# Altium schematic sheet C210_0005_NINA_Module.SchDoc: C210_0005_NINA_Module
size B; Date: 2/26/2021; CompanyName: U-blox; DrawnBy: EMOO; Engineer: EMOO; Organization: U-blox; Address1: 2601 25th St. SE; Address2: Salem, OR 97302; SheetNumber: 5; SheetTotal: 7; Website: www.u-blox.com; SheetSize: B; SheetTitle: C-210NINA Module
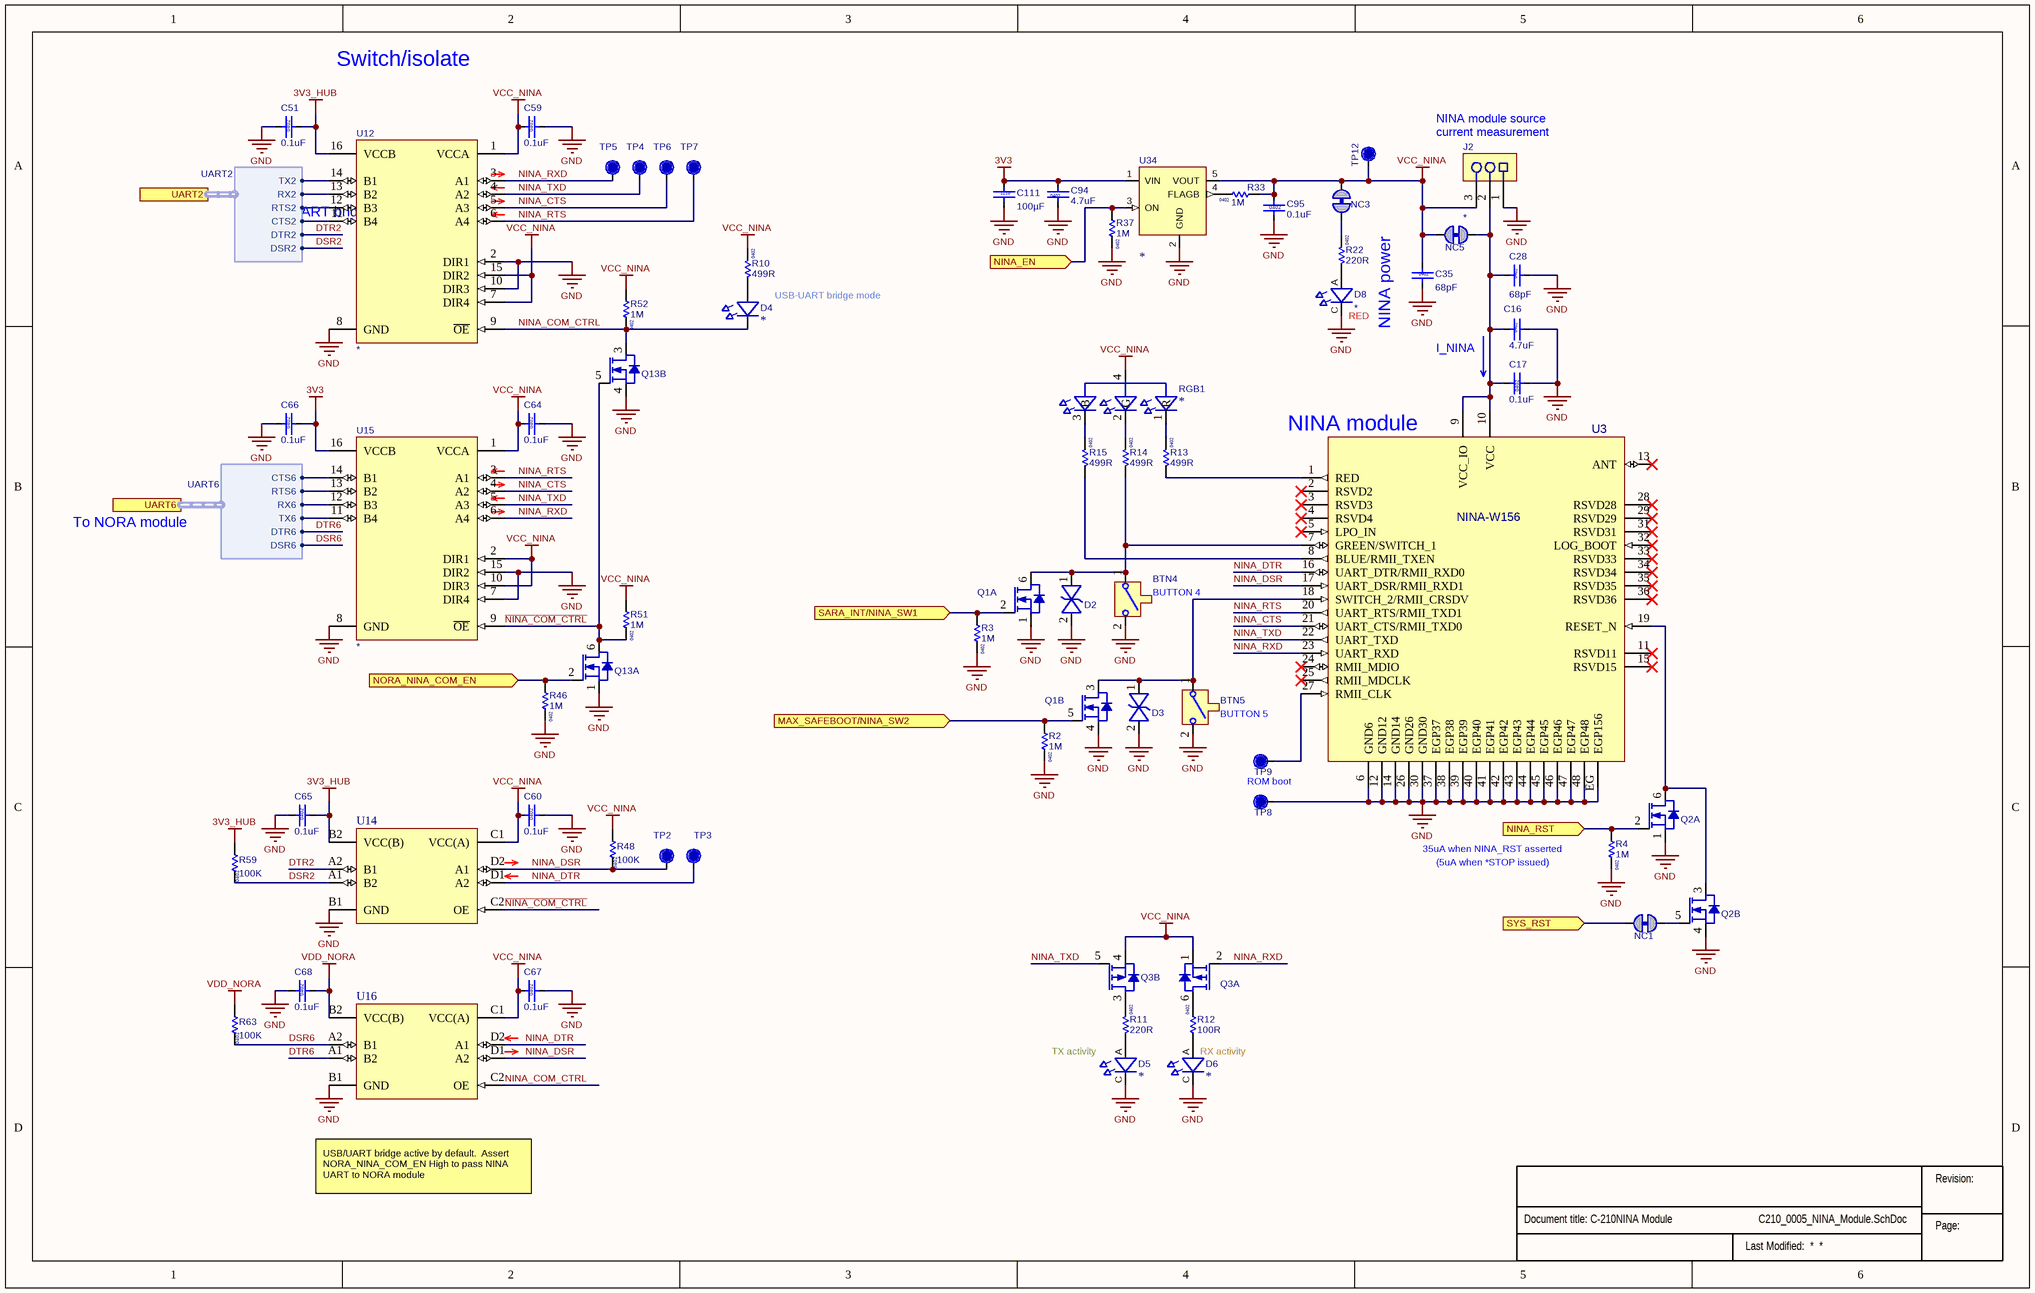
[diagram p0: C210_0005_NINA_Module.SchDoc]

## Parts
?  (no value)  (graphical)
BTN4  (no value)  [B3U-1000P]
BTN5  (no value)  [B3U-1000P]
C16  value 4.7uF  Size: 0402  [Cap 0402 HD]
C17  value 0.1uF  Size: 0402  [Cap 0402 HD]  (hidden comment: 120-000160.1uF)
C28  value 68pF  Size: 0402  [Cap 0402 HD]
C35  value 68pF  Size: 0402  [Cap 0402 HD]
C51  value 0.1uF  Size: 0402  [Cap 0402 HD]  (hidden comment: 120-000160.1uF)
C59  value 0.1uF  Size: 0402  [Cap 0402 HD]  (hidden comment: 120-000160.1uF)
C60  value 0.1uF  Size: 0402  [Cap 0402 HD]  (hidden comment: 120-000160.1uF)
C64  value 0.1uF  Size: 0402  [Cap 0402 HD]  (hidden comment: 120-000160.1uF)
C65  value 0.1uF  Size: 0402  [Cap 0402 HD]  (hidden comment: 120-000160.1uF)
C66  value 0.1uF  Size: 0402  [Cap 0402 HD]  (hidden comment: 120-000160.1uF)
C67  value 0.1uF  Size: 0402  [Cap 0402 HD]  (hidden comment: 120-000160.1uF)
C68  value 0.1uF  Size: 0402  [Cap 0402 HD]  (hidden comment: 120-000160.1uF)
C94  value 4.7uF  Size: 0402  [Cap 0402 HD]
C95  value 0.1uF  Size: 0402  [Cap 0402 HD]  (hidden comment: 120-000160.1uF)
C111  value 100µF  Size: 1210  [Cap 1210]
D2  (no value)  [SOD-523_ALT]
D3  (no value)  [SOD-523_ALT]
D4  (no value)  [LED-0603]
D5  (no value)  [LTST-C190KGKT]
D6  (no value)  [LTST-C190YKT]
D8  (no value)  [LTST-C190EKT]
J2  (no value)  [HDR-0.1P-3Pin-1Row-SMT]
NC1  Solderbridge-ShortDNP  [Solderbridge-Short]  (value not drawn)  (net tie, no BOM)
NC3  Solderbridge-ShortDNP  [Solderbridge-Short]  (value not drawn)  (net tie, no BOM)
NC5  Solderbridge-ShortDNP  [Solderbridge-Short]  (value not drawn)  (net tie, no BOM)
Q1  (no value)  [SOT-563]  (parts A,B of 2)
Q2  (no value)  [SOT-563]  (parts A,B of 2)
Q3  (no value)  [FDY2000PZ]  (parts A,B of 2)
Q13  (no value)  [SOT-563]  (parts A,B of 2)
R2  value 1M  Size: 0402  [RES 0402 HD]
R3  value 1M  Size: 0402  [RES 0402 HD]
R4  value 1M  Size: 0402  [RES 0402 HD]
R10  value 499R  Size: 0402  [RES 0402 HD]
R11  value 220R  Size: 0402  [RES 0402 HD]
R12  value 100R  Size: 0402  [RES 0402 HD]
R13  value 499R  Size: 0402  [RES 0402 HD]
R14  value 499R  Size: 0402  [RES 0402 HD]
R15  value 499R  Size: 0402  [RES 0402 HD]
R22  value 220R  Size: 0402  [RES 0402 HD]
R33  value 1M  Size: 0402  [RES 0402 HD]
R37  value 1M  Size: 0402  [RES 0402 HD]
R46  value 1M  Size: 0402  [RES 0402 HD]
R48  value 100K  Size: 0402  [RES 0402 HD]
R51  value 1M  Size: 0402  [RES 0402 HD]
R52  value 1M  Size: 0402  [RES 0402 HD]
R59  value 100K  Size: 0402  [RES 0402 HD]
R63  value 100K  Size: 0402  [RES 0402 HD]
RGB1  (no value)  [LED_1616]
TP2  TP  [TP12R]  (value not drawn)  (no BOM)
TP3  TP  [TP12R]  (value not drawn)  (no BOM)
TP4  TP  [TP12R]  (value not drawn)  (no BOM)
TP5  TP  [TP12R]  (value not drawn)  (no BOM)
TP6  TP  [TP12R]  (value not drawn)  (no BOM)
TP7  TP  [TP12R]  (value not drawn)  (no BOM)
TP8  TP  [TP12R]  (value not drawn)  (no BOM)
TP9  TP  [TP12R]  (value not drawn)  (no BOM)
TP12  TP  [TP12R]  (value not drawn)  (no BOM)
U3  NINA-W156  [NINA_LGA48R_1400X1000X223_PCB]
U12  (no value)  [QFN0.5P2x6-16Pin_W-Pad]
U14  (no value)  [TXS0102YZP]
U15  (no value)  [QFN0.5P2x6-16Pin_W-Pad]
U16  (no value)  [TXS0102YZP]
U34  (no value)  [SOT-23-5_2]

## Ports
MAX_SAFEBOOT/NINA_SW2 (in), NINA_EN (in), NINA_RST (in), NORA_NINA_COM_EN (in), SARA_INT/NINA_SW1 (in), SYS_RST (in), UART2 (harness UART2), UART6 (harness UART6)

## Harnesses
UART6: TX6, RX6, RTS6, CTS6, DTR6, DSR6
UART2: TX2, RX2, RTS2, CTS2, DTR2, DSR2

## Nets
3V3: C66.2 C94.2 C111.1 U15.16(VCCB) U34.1(VIN)
3V3_HUB: C51.2 C65.2 R59.1 U12.16(VCCB) U14.B2(VCC(B))
GND: BTN4.2 BTN5.2 C16.2 C17.1 C28.2 C35.2 C51.1 C59.2 C60.2 C64.2 C65.1 C66.1 C67.2 C68.1 C94.1 C95.2 C111.2 D2.2 D3.2 D5.C(Cathode) D6.C(Cathode) D8.C(Cathode) J2.1 Q1.1(S1) Q1.4(S2) Q2.1(S1) Q2.4(S2) Q13.1(S1) Q13.4(S2) R2.2 R3.2 R4.2 R37.2 R46.2 TP8.1 U3.6(GND6) U3.12(GND12) U3.14(GND14) U3.26(GND26) U3.30(GND30) U3.37(EGP37) U3.38(EGP38) U3.39(EGP39) U3.40(EGP40) U3.41(EGP41) U3.42(EGP42) U3.43(EGP43) U3.44(EGP44) U3.45(EGP45) U3.46(EGP46) U3.47(EGP47) U3.48(EGP48) U3.EG(EGP156) U12.2(DIR1) U12.8(GND) U12.10(DIR3) U14.B1(GND) U15.7(DIR4) U15.8(GND) U15.15(DIR2) U16.B1(GND) U34.2(GND)
VCC_NINA: C35.1 C59.1 C60.1 C64.1 C67.1 C95.1 J2.3 NC3.1 NC5.2 Q3.1(S1) Q3.4(S2) R10.2 R33.1 R48.1 R51.1 R52.1 RGB1.4(A) TP12.1 U12.1(VCCA) U12.7(DIR4) U12.15(DIR2) U14.C1(VCC(A)) U15.1(VCCA) U15.2(DIR1) U15.10(DIR3) U16.C1(VCC(A)) U34.5(VOUT)
VDD_NORA: C68.2 R63.1 U16.B2(VCC(B))
DSR2: R59.2 U14.A1(B2) ; port UART2.DSR2
DSR6: R63.2 U16.A2(B1) ; port UART6.DSR6
DTR2: U14.A2(B1) ; port UART2.DTR2
DTR6: U16.A1(B2) ; port UART6.DTR6
MAX_SAFEBOOT/NINA_SW2: Q1.5(G2) R2.1 ; port MAX_SAFEBOOT/NINA_SW2
~{NINA_COM_CTRL}: Q13.5(G2) Q13.6(D1) R51.2 U14.C2(OE) U15.9(~{OE})
NINA_COM_CTRL: D4.1(C) Q13.3(D2) R52.2 U12.9(~{OE}) U16.C2(OE)
NINA_CTS: TP6.1 U3.21(UART_CTS/RMII_TXD0) U12.5(A3) U15.4(A2)
NINA_DSR: R48.2 TP2.1 U3.17(UART_DSR/RMII_RXD1) U14.D2(A1) U16.D1(A2)
NINA_DTR: TP3.1 U3.16(UART_DTR/RMII_RXD0) U14.D1(A2) U16.D2(A1)
NINA_EN: R37.1 U34.3(ON) ; port NINA_EN
NINA_RST: Q2.2(G1) R4.1 ; port NINA_RST
NINA_RTS: TP7.1 U3.20(UART_RTS/RMII_TXD1) U12.6(A4) U15.3(A1)
NINA_RXD: Q3.2(G1) TP5.1 U3.23(UART_RXD) U12.3(A1) U15.6(A4)
NINA_TXD: Q3.5(G2) TP4.1 U3.22(UART_TXD) U12.4(A2) U15.5(A3)
NORA_NINA_COM_EN: Q13.2(G1) R46.1 ; port NORA_NINA_COM_EN
SARA_INT/NINA_SW1: Q1.2(G1) R3.1 ; port SARA_INT/NINA_SW1
SYS_RST: NC1.2 ; port SYS_RST
NetBTN4_1: BTN4.1 D2.1 Q1.6(D1) R14.1 U3.7(GREEN/SWITCH_1)
NetBTN5_1: BTN5.1 D3.1 Q1.3(D2) U3.18(SWITCH_2/RMII_CRSDV)
NetC16_1: C16.1 C17.2 C28.1 J2.2 NC5.1 U3.9(VCC_IO) U3.10(VCC)
NetD4_2: D4.2(A) R10.1
NetD5_A: D5.A(Anode) R11.1
NetD6_A: D6.A(Anode) R12.1
NetD8_A: D8.A(Anode) R22.1
NetNC1_1: NC1.1 Q2.5(G2)
NetNC3_2: NC3.2 R22.2
NetQ2_3: Q2.3(D2) Q2.6(D1) U3.19(RESET_N)
NetQ3_3: Q3.3(D2) R11.2
NetQ3_6: Q3.6(D1) R12.2
NetR13_1: R13.1 U3.1(RED)
NetR13_2: R13.2 RGB1.1(R)
NetR14_2: R14.2 RGB1.2(G)
NetR15_1: R15.1 U3.8(BLUE/RMII_TXEN)
NetR15_2: R15.2 RGB1.3(B)
NetR33_2: R33.2 U34.4(FLAGB)
NetTP9_1: TP9.1 U3.27(RMII_CLK)
NetU12_11: U12.11(B4) ; port UART2.CTS2
NetU12_12: U12.12(B3) ; port UART2.RTS2
NetU12_13: U12.13(B2) ; port UART2.RX2
NetU12_14: U12.14(B1) ; port UART2.TX2
NetU15_11: U15.11(B4) ; port UART6.TX6
NetU15_12: U15.12(B3) ; port UART6.RX6
NetU15_13: U15.13(B2) ; port UART6.RTS6
NetU15_14: U15.14(B1) ; port UART6.CTS6

Not connected (* = marked no-connect by the designer): U3 2(RSVD2)* 3(RSVD3)* 4(RSVD4)* 5(LPO_IN)* 11(RSVD11)* 13(ANT)* 15(RSVD15)* 24(RMII_MDIO)* 25(RMII_MDCLK)* 28(RSVD28)* 29(RSVD29)* 31(RSVD31)* 32(LOG_BOOT)* 33(RSVD33)* 34(RSVD34)* 35(RSVD35)* 36(RSVD36)*

## Notes on the sheet
- Switch/isolate
- NINA module source
- (near J2) current measurement
- To USB-UART bridge
- USB-UART bridge mode
- (near D8) RED
- NINA power
- I_NINA
- (near U3) NINA module
- To NORA module
- (near BTN4) BUTTON 4
- BUTTON 5
- ROM boot
- 35uA when NINA_RST asserted
- (5uA when *STOP issued)
- TX activity
- (near D6) RX activity
- USB/UART bridge active by default.  Assert NORA_NINA_COM_EN High to pass NINA UART to NORA module
- Revision:
- Page:

## Library data of the parts
? = Sub_Title_Block: Minimized schematic title block for all subset sheets
BTN4 BTN5 = 135-00007: Button, Momentary SPST-NO, 0.05A, 12V, 3mm x 2.5mm; Manufacturer 1: Omron Electronics Inc-EMC Div; Part Name: SWITCH TACTILE SPST-NO 0.05A 12V; Current: 50mA; Item Phase: In Production; Use in new designs: Yes; Voltage: 12VDC; UBX Code: None; Part Number: 135-00007; Manufacturer Part Number 1: B3U-1000P; Supplier 1: Digi-Key; Supplier Part Number 1: SW1020CT-ND; Body Size: 3mm x 2.5mm; Height: 1.2mm; Max Operating Temp: 70; Min Operating Temp: -25; Pins: 2; Revision: 0A; Manufacturer 2: None; Manufacturer Part Number 2: None; Supplier 2: None; Supplier Part Number 2: None
C16 C94 = 120-00020: Cap, Ceramic 4.7uF 10V 20% X5R 0402; Manufacturer 1: Samsung Electro-Mechanics America, Inc; Manufacturer Part Number 1: CL05A475MP5NRNC; Part Name: CAP CER 4.7uF 10V 20% X5R 0402; Item Phase: In Production; Tolerance: +/- 20%; Use in new designs: Yes; UBX Code: None; Part Number: 120-00020; Supplier 1: Digi-Key; Supplier Part Number 1: 1276-1482-1-ND; Manufacturer 2: Yageo; Manufacturer Part Number 2: CC0402KRX5R6BB475; Supplier 2: Digi-Key; Supplier Part Number 2: 311-3477-1-ND; Height: 0.55mm; Max Operating Temp: 85; Min Operating Temp: -55; Pins: 2; Revision: 0C; Temperature Coefficient: X5R; Voltage: 10V
C17 C51 C59 C60 C64-C68 C95 = 120-00016: Cap, Ceramic 0.1uF 10V 10% X5R 0402; Part Name: CAP CER 0.1UF 10V 10% X5R 0402; Part_Type: Ceramic Capacitor; Manufacturer: Murata Electronics North America; Manufacturer P/N: GRM155R61A104KA01J; Item_Phase: Production; Component Mounting Type: SMT; Tolerance: +/- 10%; Use in new designs: Yes; Part Number: 120-00016; Revision: 0A; Supplier 1: Digi-Key; Supplier Part Number 1: 490-6297-1-ND; Manufacturer 2: Yageo; Manufacturer P/N 2: CC0402KRX5R6BB104; Supplier 2: Digi-Key; Supplier Part Number 2: 311-1336-1-ND; Arena Link: https://app.bom.com/a/GYHPV2L2L43KRMBK?v=spec.summary; Height: 0.55mm; Pins: 2; Temperature Coefficient: X5R; Voltage: 10V
C28 C35 = 120-00047: Cap, Ceramic, 68pF, 50V, 1%, NP0, 0402; Manufacturer 1: Murata Electronics North America; Manufacturer Part Number 1: GRM1555C1H680FA01D; Part Name: CAP CER 68PF 50V 1% NP0 0402; Item Phase: Unreleased; Tolerance: +/- 1%; Use in new designs: Yes; UBX Code: None; Part Number: 120-00047; Supplier 1: Digi-Key; Supplier Part Number 1: 490-8219-1-ND; Manufacturer 2: AVX Corporation; Manufacturer Part Number 2: 04025A680FAT2A; Supplier 2: Digi-Key; Supplier Part Number 2: 478-7881-1-ND; Height: 0.55mm; Max Operating Temp: 125; Min Operating Temp: -55; Pins: 2; Revision: None; Temperature Coefficient: NP0; Voltage: 50V
C111 = 120-00223: 100µF ±20% 10V Ceramic Capacitor X5R 1210 (3225 Metric); Manufacturer 1: Samsung Electro-Mechanics America, Inc.; Manufacturer Part Number 1: CL32A107MPVNNNE; Part Name: CAP CER 100UF 10V 20% X5R 1210; Item Phase: In Production; Tolerance: +/- 20%; Use in new designs: Yes; UBX Code: None; Part Number: 120-00223; Supplier 1: Future Electronics; Supplier Part Number 1: Samsung Electro-Mechanics America, Inc. CL32A107MPVNNNE; Manufacturer 2: None; Manufacturer Part Number 2: None; Supplier 2: None; Supplier Part Number 2: None; Height: 2.8mm; Max Operating Temp: 85; Min Operating Temp: -55; Pins: 2; Revision: 0A; Temperature Coefficient: X5R; Voltage: 10V
D2 D3 = 110-00041: Diode TVS 5VWM BiDIR SOD523; Manufacturer 1: ON Semiconductor; Manufacturer Part Number 1: ESD5B5.0ST1G; Part Name: Diode TVS 5VWM SOD523; Body Size: 1.2mm x 0.8mm; Current: None; Item Phase: Unreleased; MFG Package: SOD-523; Use in new designs: Yes; Part Number: 110-00041; Supplier 1: Digi-Key; Supplier Part Number 1: ESD5B5.0ST1GOSCT-ND; Manufacturer 2: None; Manufacturer Part Number 2: None; Supplier 2: None; Supplier Part Number 2: None; Height: 0.7mm; Max Operating Temp: 150; Min Operating Temp: -55; Pins: 2; Revision: None; Voltage: 5VWM; UBX Code: None
D4 = 115-00023: LED BLUE DIFFUSED 0603 SMD; Manufacturer 1: OSRAM Opto Semiconductors Inc; Manufacturer Part Number 1: LB Q39G-L2OO-35-1; Body Size: None; Item Phase: Unreleased; Color: *; Part Number: 115-00023; Supplier 1: Digi-Key; Supplier Part Number 1: 475-2816-1-ND; Current: None; Height: None; MFG Package: None; Max Operating Temp: None; Min Operating Temp: None; Part Name: LED BLUE DIFFUSED 0603 SMD; Pins: None; Revision: None; Size: None; Use in new designs: None; Voltage: None; UBX Code: None; Manufacturer 2: None; Manufacturer Part Number 2: None; Supplier 2: None; Supplier Part Number 2: None
D5 = LTST-C190KGKT: DIODE, LED, SMT, GREEN, CLEAR LENS, 2.0V 20mA, 0603; Part Number: 115-00019; Manufacturer 1: Lite-On Inc; Part Name: LED Green SMT 0603; Body Size: 1.60mm x 0.80mm; Item Phase: In Production; MFG Package: None; Use in new designs: Yes; Manufacturer Part Number 1: LTST-C190KGKT; Supplier 1: Digi-Key; Supplier Part Number 1: 160-1435-2-ND; Current: 20mA; Height: 0.80mm; Max Operating Temp: 85; Min Operating Temp: -30; Pins: 2; Revision: 0A; Size: 0603; Voltage: 2.0V; UBX Code: None; Manufacturer 2: None; Manufacturer Part Number 2: None; Supplier 2: None; Supplier Part Number 2: None; Color: *
D6 = LTST-C190YKT: DIODE, LED, SMT, YELLOW, CLEAR LENS, 2.1V 10mA, 0603; Manufacturer 1: Lite-On Inc; Part Name: LED Yellow SMT 0603; Body Size: 1.60mm x 0.80mm; Item Phase: In Production; MFG Package: None; Use in new designs: Yes; Part Number: LTST-C190YKT; Manufacturer Part Number 1: LTST-C190YKT; Supplier 1: Digi-Key; Supplier Part Number 1: 160-1184-2-ND; Current: 10mA; Height: 0.80mm; Max Operating Temp: 85; Min Operating Temp: -30; Pins: 2; Revision: 0A; Size: 0603; Voltage: 2.1V; UBX Code: None; Manufacturer 2: None; Manufacturer Part Number 2: None; Supplier 2: None; Supplier Part Number 2: None; Color: *
D8 = LTST-C190EKT: DIODE, LED, SMT, Red, CLEAR LENS, 2.0V 10mA, 0603; Manufacturer 1: Lite-On Inc; Part Name: LED Red SMT 0603; Body Size: 1.60mm x 0.80mm; Item Phase: In Production; MFG Package: None; Use in new designs: Yes; Part Number: LTST-C190EKT; Manufacturer Part Number 1: LTST-C190EKT; Supplier 1: Digi-Key; Supplier Part Number 1: 160-1182-2-ND; Current: 10mA; Height: 0.80mm; Max Operating Temp: 85; Min Operating Temp: -30; Pins: 2; Revision: 0A; Size: 0603; Voltage: 2.0V; UBX Code: None; Manufacturer 2: None; Manufacturer Part Number 2: None; Supplier 2: None; Supplier Part Number 2: None; Color: *
J2 = 130-00105: Header, 0.100" Pitch, 3 Pin, Vertical SMT, Black; Manufacturer 1: Harwin Inc; Manufacturer Part Number 1: M20-8770342; Part Name: CON HDR 0.1" 3 Pin 1 Row SMT; Item Phase: In Production; Use in new designs: Yes; Voltage: None; Manufacturer P/N: *; Part Number: 130-00105; Supplier 1: Digi-Key; Supplier Part Number 1: 952-1951-ND; Diameter: None; Height: 9.93mm; Max Operating Temp: None; Min Operating Temp: None; Pins: 3; Revision: 0C; UBX Code: None; Manufacturer 2: Greenconn Corporation; Manufacturer Part Number 2: GPHC1010302A081B1BD; Supplier 2: Teamwise Limited; Supplier Part Number 2: Greenconn Corporation GPHC1010302A081B1BD
NC1 NC3 NC5 = Solderbridge-Short: Added By: Paul B; Part Number: Solderbridge-Short; Height: 0; DNP: DNP; Added Date: 12/2/2015
Q1 Q2 Q13 = 140-00016: MOSFET 2N-CH 20V 0.8A, SOT-563; Manufacturer 1: Toshiba Semiconductor and Storage; Manufacturer Part Number 1: SSM6N56FE,LM; Part Name: MOSFET 2N-CH 20V 0.8A SOT-563; Body Size: 1.6mm x 1.2mm; Current: 800mA; Item Phase: In Production; Transistor Type: N-Channel; Thermal Pad: No; Use in new designs: Yes; UBX Code: None; Part Number: 140-00016; Supplier 1: Digi-Key; Supplier Part Number 1: SSM6N56FELMCT-ND; Height: 0.6mm; MFG Package: SOT-563; Max Operating Temp: 150; Min Operating Temp: -55; Pins: 6; Revision: 0A; Voltage: 20V; Manufacturer 2: None; Manufacturer Part Number 2: None; Supplier 2: None; Supplier Part Number 2: None
Q3 = FDY2000PZ: MOSFET DUAL P-CH 20V SOT-563, -350mA; Manufacturer 1: ON Semiconductor; Body Size: 1.6mmx1.6mm; Item Phase: In Production; Transistor Type: Multiple; Thermal Pad: No; Use in new designs: Yes; UBX Code: None; Part Number: FDY2000PZ; Manufacturer Part Number 1: FDY2000PZ; Supplier 1: Digi-Key; Supplier Part Number 1: 2156-FDY2000PZ-ND; Current: -350mA; Height: 0.6mm; MFG Package: SOT-563; Max Operating Temp: 150; Min Operating Temp: -55; Part Name: MOSFET DUAL P-CH 20V SOT-563; Pins: 6; Revision: 0A; Voltage: 20V; Manufacturer 2: Diodes, Inc.; Manufacturer Part Number 2: DMP2004VK-7; Supplier 2: None; Supplier Part Number 2: None
R2-R4 R33 R37 R46 R51 R52 = 180-00054: Resistor 1M ohm 1%, 1/16W, 0402; Manufacturer 1: Samsung Electro-Mechanics America, Inc; Manufacturer Part Number 1: RC1005F105CS; Part Name: RES SMD 1M OHM 1% 1/16W 0402; Item Phase: In Production; Tolerance: +/- 1%; Use in new designs: Yes; Voltage: None; Part Number: 180-00054; Supplier 1: Digi-Key; Supplier Part Number 1: 1276-3433-1-ND; Manufacturer 2: Hong Kong Resistors Manufactory; Manufacturer Part Number 2: RCT021MFLF; Supplier 2: None; Supplier Part Number 2: None; Height: 0.4mm; Max Operating Temp: 155; Min Operating Temp: -55; Pins: 2; Power: 1/16W; Revision: 0D; UBX Code: None
R10 R13-R15 = 180-00031: Resistor, 499ohm, 1%, 1/16W, 0402; Part Name: RES SMD 499 OHM 1% 1/16W 0402; Manufacturer: Rohm Semiconductor; Manufacturer P/N: MCR01MRTF4990; Item_Phase: Production; Component Mounting Type: SMT; Tolerance: +/- 1%; Use in new designs: Yes; Part Number: 180-00031; Part_Type: Resistor; Supplier 1: Digi-Key; Supplier Part Number 1: RHM499CDCT-ND; Manufacturer 2: Samsung Electro-Mechanics America, Inc; Manufacturer P/N 2: RC1005F4990CS; Arena Link: https://app.bom.com/a/Q8RZ5CVCVEDU1SS5?v=spec.summary; Height: 0.4mm; Pins: 2; Power: 1/16W; Revision: 0D; Supplier 2: Digi-Key; Supplier Part Number 2: 1276-3992-1-ND; Alternate Footprint Ref: RES 0402
R11 R22 = 180-00098: Resistor, 220ohm, 5%, 1/16W, 0402.; Part Name: RES SMD 220 OHM 5% 1/16W 0402; Manufacturer: Panasonic Electronic Components; Manufacturer P/N: ERJ-2GEJ221X; Item_Phase: Production; Component Mounting Type: SMT; Tolerance: +/- 5%; Use in new designs: Yes; Part Number: 180-00098; Part_Type: Resistor; Supplier 1: Digi-Key; Supplier Part Number 1: P220JCT-ND; Arena Link: https://app.bom.com/a/8Q9HNUDUDWVBJC30?v=spec.summary; Pins: 2; Power: 1/16W; Revision: 0C; Manufacturer 2: Samsung Electro-Mechanics America, Inc; Manufacturer P/N 2: RC1005J221CS; Supplier 2: Digi-Key; Supplier Part Number 2: 1276-4360-1-ND; Alternate Footprint Ref: RES 0402; Height: 0.4mm
R12 = 180-00051: Resistor, 100ohm, 1%, 1/16W, 0402.; Manufacturer 1: Hong Kong Resistors Manufactory; Manufacturer Part Number 1: RCT02100RFLF; Part Name: RES SMD 100 OHM 1% 1/16W 0402; Item Phase: In Production; Tolerance: +/- 1%; Use in new designs: Yes; Voltage: None; Part Number: 180-00051; Supplier 1: None; Supplier Part Number 1: None; Manufacturer 2: Stackpole Electronics Inc.; Manufacturer Part Number 2: RMCF0402FT100R; Supplier 2: Digi-Key; Supplier Part Number 2: RMCF0402FT100RCT-ND; Height: 0.4mm; Max Operating Temp: 155; Min Operating Temp: -55; Pins: 2; Power: 1/16W; Revision: 0E; UBX Code: None
R48 R59 R63 = 180-00093: Resistor 100K ohm 1% 1/16W, 0402; Manufacturer 1: Yageo; Manufacturer Part Number 1: RC0402FR-07100KL; Part Name: RES SMD 100K ohm 1% 1/16W 0402; Item Phase: In Production; Tolerance: +/- 1%; Use in new designs: Yes; Voltage: None; Part Number: 180-00093; Supplier 1: Digi-Key; Supplier Part Number 1: 311-100KLRCT-ND; Manufacturer 2: Rohm Semiconductor; Manufacturer Part Number 2: MCR01MRTF1003; Supplier 2: Digi-Key; Supplier Part Number 2: RHM100KCDCT-ND; Height: 0.4mm; Max Operating Temp: 155; Min Operating Temp: -55; Pins: 2; Power: 1/16W; Revision: 0B; UBX Code: None
RGB1 = 115-00026: LED RGB SMT 0606; Manufacturer 1: Lite-On Inc; Manufacturer Part Number 1: LTST-C19HE1WT; Body Size: 1.6mm x 1.6mm; Current: 20mA; Item Phase: In Production; MFG Package: 0606; Use in new designs: Yes; Voltage: None; Color: *; Part Number: 115-00026; Supplier 1: Digi-Key; Supplier Part Number 1: 160-2162-1-ND; Height: 0.35mm; Max Operating Temp: 80; Min Operating Temp: -20; Part Name: LED RGB SMT 0606; Pins: 4; Revision: 0B; Size: Other; UBX Code: None; Manufacturer 2: QT Brightek (QTB); Manufacturer Part Number 2: QBLP600-RGB; Supplier 2: Digi-Key; Supplier Part Number 2: 1516-1184-1-ND
TP2-TP9 TP12 = TP_R: Testpoint, Round 1.0mm Dia; Part Number: TP10R; Added By: Jeremy D; Size: 1.0mm; Height: 0; DNP: DNP; Added Date: 2/1/2015; Checked By: Paul B; Checked Date: 2/5/2015
U3 = NINA-W156: u-blox NINA-W156 WiFi, Bluetooth dual-mode module; Part Description: Stand-alone Bluetooth low energy module; Manufacturer Part Number 1: NINA-W156-03B-00; Manufacturer: u-blox; Value: NINA-W156; Manufacturer 1: u-blox
U12 U15 = 225-00011: Voltage Level Translator Bidirectional 1 Circuit 4 Channel 380Mbps 16-DHVQFN (2.5x3.5); Manufacturer 1: NXP Semiconductors; Manufacturer Part Number 1: 74AVC4TD245BQ,115; Part Name: TXRX XLATING BIDIR 4CH 16-DHVQFN; Body Size: 2.5mm x 3.5mm; Item Phase: In Production; SMT Pitch: 0.5mm; Thermal Pad: Yes; Voltage: 3.6V; UBX Code: None; Manufacturer P/N: *; Part Number: 225-00011; Supplier 1: Digi-Key; Supplier Part Number 1: 568-9220-1-ND; Height: 1mm; Logic Type: Level Translator; MFG Package: 16-DHVQFN; Max Operating Temp: 125; Min Operating Temp: -40; Pins: 16; Revision: 0B; Use in new designs: Yes; Manufacturer 2: ON Semiconductor; Manufacturer Part Number 2: FXL4TD245BQX; Supplier 2: Digi-Key; Supplier Part Number 2: FXL4TD245BQXCT-ND
U14 U16 = TXS0102YZP: IC, SMT, LEVEL TRANSLATOR, DUAL, BIDIRECTIONAL, DSBGA-8 1.9mmX0.9mm; Manufacturer 1: Texas Instruments; Manufacturer Part Number 1: TXS0102YZPT; Current: None; Item Phase: In Production; Use in new designs: Yes; Part Number: TXS0102YZP; Manufacturer 2: Texas Instruments; Manufacturer Part Number 2: TXS0102YZPR; Body Size: 1.9mm x 0.9mm; Height: 0.65mm; MFG Package: DSBGA-8; Max Operating Temp: 85; Min Operating Temp: -40; Part Name: TXS0102YZP; Pins: 8; Revision: 0A; Voltage: N/A; UBX Code: None
U34 = FPF2104: Load Switch, 400mA, 1.8-5.5V, Active High Enable, SOT-23-5; Manufacturer 1: onsemi; Current: None; Item Phase: In Production; Use in new designs: Yes; Voltage: 5.5V; Manufacturer Part Number 1: FPF2104; Manufacturer 2: None; Manufacturer Part Number 2: None; Supplier 2: None; Supplier Part Number 2: None; Body Size: SOT-23-5; Height: 1.2mm; MFG Package: SOT-23-5; Max Operating Temp: 85; Min Operating Temp: -40; Pins: 5; Revision: 0A; UBX Code: None; Manufacturer P/N: *